# Altium schematic sheet Camera.SchDoc
size A4
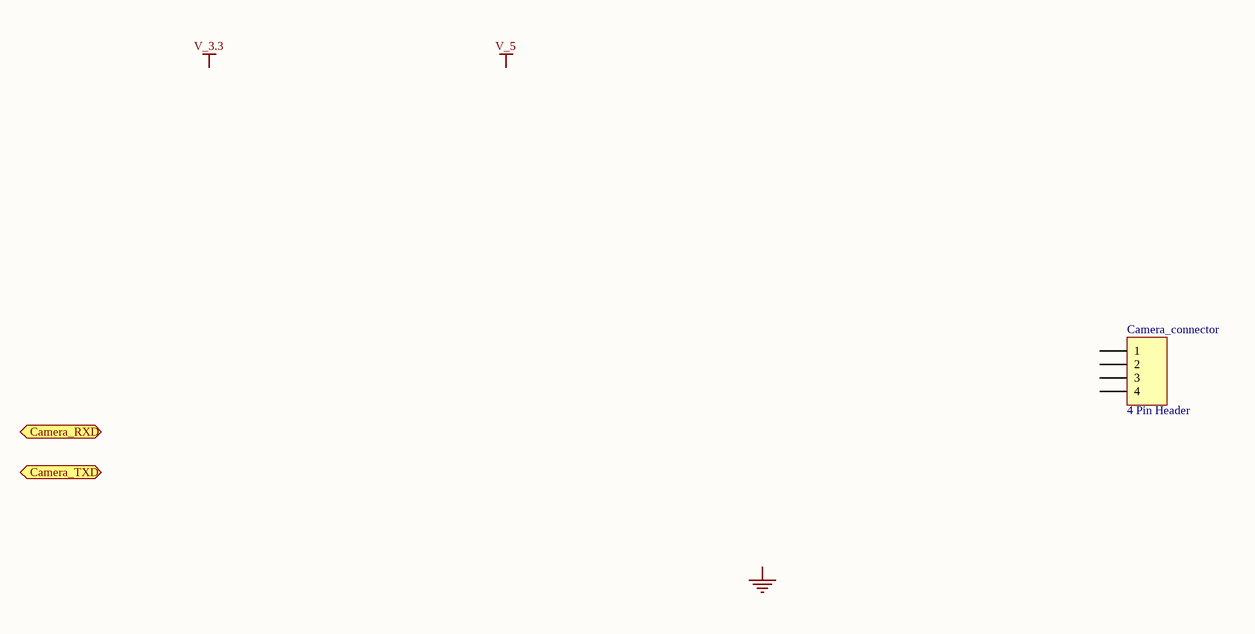
[diagram p0: Camera.SchDoc]

## Parts
Camera_connector  4 Pin Header  [CONN_4X1_SMT_RA_1.25MM]

## Ports
Camera_RXD, Camera_TXD

## Nets

Not connected (* = marked no-connect by the designer): Camera_connector 1 2 3 4

## Notes on the sheet
- Labels drawn without touching a wire or pin: GND, V_3.3, V_5

## Library data of the parts
Camera_connector = JP_4PIN HDR_SMT_RA_MOLEX_1: CONN HDR VERT 4POS .100" SNGL; Manufacturer: Molex; Manufacturer PN: 53261-0471; Verify: Not Checked; LatestRevisionDate: 24 Jun 08; Supplier_Component_Code: WM7622CT-ND; Supplier_Name: Digikey; Supplier 1: Digi-Key; Supplier Part Number 1: WM7622CT-ND; Value: 4 Pin Header